# Altium schematic sheet Interconnect.SchDoc
size A4; SheetNumber: 10; SheetTotal: 15
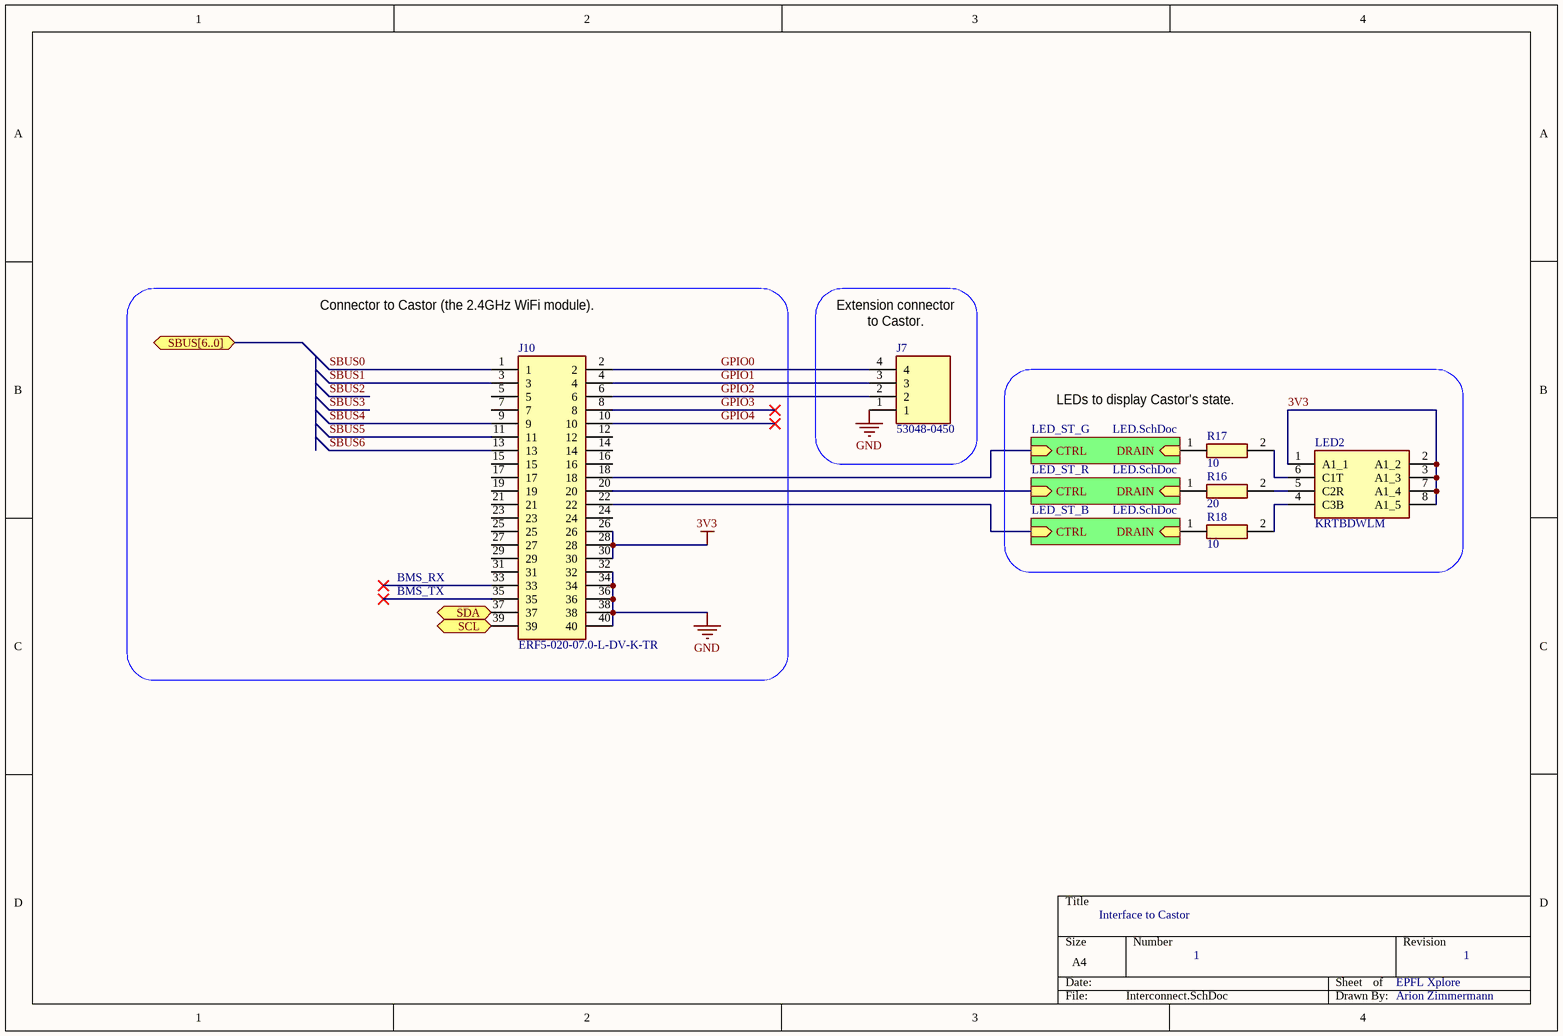
[diagram p0: Interconnect.SchDoc]

## Parts
J7  53048-0450  [SHDRRA4W35P0X125_1X4_675X550X350P]
J10  ERF5-020-07.0-L-DV-K-TR  [ERF5-020-XX.X-Y-DV-K-TR]
LED2  KRTBDWLM  [KRTBDWLM3232T4U6JWAAABJ3R4S65V]
R16  value 20  [RESC1608X55N]  (hidden comment: CRCW060320R0FKEAC)
R17  value 10  [RESC1608X55N]  (hidden comment: CRCW060310R0JNEAC)
R18  value 10  [RESC1608X55N]  (hidden comment: CRCW060310R0JNEAC)

## Sub-sheets
LED_ST_B = LED.SchDoc: CTRL (in), DRAIN (in)
LED_ST_G = LED.SchDoc: CTRL (in), DRAIN (in)
LED_ST_R = LED.SchDoc: CTRL (in), DRAIN (in)

## Ports
SBUS[6..0] (bidir), SCL (bidir), SDA (bidir)

## Nets
3V3: J10.26 J10.28 J10.30 LED2.1(A1_1) LED2.2(A1_2) LED2.3(A1_3) LED2.7(A1_4) LED2.8(A1_5)
GND: J7.1 J10.32 J10.34 J10.36 J10.38 J10.40
GPIO0: J7.4 J10.2
GPIO1: J7.3 J10.4
GPIO2: J7.2 J10.6
GPIO3: J10.8
GPIO4: J10.10
SBUS0: J10.1
SBUS1: J10.3
SBUS4: J10.9
SBUS5: J10.11
SBUS6: J10.13
SCL: J10.39 ; port SCL
SDA: J10.37 ; port SDA
NetJ10_18: J10.18 ; sheet LED_ST_G/CTRL
NetJ10_20: J10.20 ; sheet LED_ST_R/CTRL
NetJ10_22: J10.22 ; sheet LED_ST_B/CTRL
NetLED2_4: LED2.4(C3B) R18.2
NetLED2_5: LED2.5(C2R) R16.2
NetLED2_6: LED2.6(C1T) R17.2
NetR16_1: R16.1 ; sheet LED_ST_R/DRAIN
NetR17_1: R17.1 ; sheet LED_ST_G/DRAIN
NetR18_1: R18.1 ; sheet LED_ST_B/DRAIN

Not connected (* = marked no-connect by the designer): J10 5 7 12 14 15 16 17 19 21 23 24 25 27 29 31 33* 35*

## Notes on the sheet
- (near J10) Connector to Castor (the 2.4GHz WiFi module).
- (near J7) Extension connector to Castor.
- (near R17) LEDs to display Castor's state.
- BMS_RX
- BMS_TX
- Interface to Castor
- 1
- EPFL Xplore
- Arion Zimmermann

## Library data of the parts
J7 = 53048-0450: Connector; Manufacturer_Name: Molex; Datasheet Link: https://www.molex.com/pdm_docs/sd/530480450_sd.pdf; Height: 3.5mm; Manufacturer_Part_Number: 53048-0450; Mouser Part Number: 538-53048-0450; Mouser Price/Stock: https://www.mouser.co.uk/ProductDetail/Molex/53048-0450?qs=0lSvoLzn4L%252Bhzo05ywM78Q%3D%3D
J10 = ERF5-020-07.0-L-DV-K-TR: Connector; Manufacturer_Name: SAMTEC; Datasheet Link: http://suddendocs.samtec.com/prints/erf5-xxx-xx.x-x-dv-xx-tr-mkt.pdf; Manufacturer_Part_Number: ERF5-020-07.0-L-DV-K-TR; Mouser Part Number: 200-ERF5020070LDVKTR; Mouser Price/Stock: https://www.mouser.co.uk/ProductDetail/Samtec/ERF5-020-070-L-DV-K-TR?qs=PB6%2FjmICvI2cw95I39aPSA%3D%3D; Arrow Part Number: ERF5-020-07.0-L-DV-K-TR; Arrow Price/Stock: https://www.arrow.com/en/products/erf5-020-07.0-l-dv-k-tr/samtec; System: Connector
LED2 = KRTBDWLM32.32-T4U6-JW+AAAB-J3+R4S6-5V: LED; Manufacturer_Name: OSRAM; Datasheet Link: https://dammedia.osram.info/media/resource/hires/osram-dam-12226989/KRTBDWLM32.32_EN.pdf; Height: 0.7mm; Manufacturer_Part_Number: KRTBDWLM32.32-T4U6-JW+AAAB-J3+R4S6-5V; Mouser Part Number: 720-KRTBDWLM323A7940; Mouser Price/Stock: https://www.mouser.co.uk/ProductDetail/OSRAM-Opto-Semiconductors/KRTBDWLM3232-T4U6-JW%2bAAAB-J3%2bR4S6-5V?qs=DPoM0jnrROWJ%2F8aeLsBacQ%3D%3D; Supplier 1: Mouser; Supplier Part Number 1: 720-KRTBDWLM323A7940
R16 = CRCW060320R0FKEAC: Resistor; Manufacturer_Name: Vishay; Datasheet Link: http://www.vishay.com/docs/28773/crcwce3.pdf; Height: 0.55mm; Manufacturer_Part_Number: CRCW060320R0FKEAC; Mouser Part Number: 71-CRCW060320R0FKEAC; Mouser Price/Stock: https://www.mouser.com/Search/Refine.aspx?Keyword=71-CRCW060320R0FKEAC; Arrow Part Number: CRCW060320R0FKEAC; Arrow Price/Stock: https://www.arrow.com/en/products/crcw060320r0fkeac/vishay; Supplier 1: Mouser; Supplier Part Number 1: 71-CRCW060320R0FKEAC
R17 R18 = CRCW060310R0FKEAC: Resistor; Manufacturer_Name: Vishay; Datasheet Link: https://ms.componentsearchengine.com/Datasheets/1/CRCW060310R0FKEAC.pdf; Height: 0.55mm; Manufacturer_Part_Number: CRCW060310R0FKEAC; Mouser Part Number: 71-CRCW060310R0FKEAC; Mouser Price/Stock: https://www.mouser.co.uk/ProductDetail/Vishay-Dale/CRCW060310R0FKEAC?qs=E3Y5ESvWgWP5XvJ40P8QAg%3D%3D; Arrow Part Number: CRCW060310R0FKEAC; Arrow Price/Stock: https://www.arrow.com/en/products/crcw060310r0fkeac/vishay; Supplier 1: Distrelec; Supplier Part Number 1: 16059657